# EasyEDA schematic FPC-024.json
TITLE: Sheet_1; REV: 1.0; Date: 2021-04-30; Sheet: 1/1; Drawn By: bigjohnson; Company: Your Company
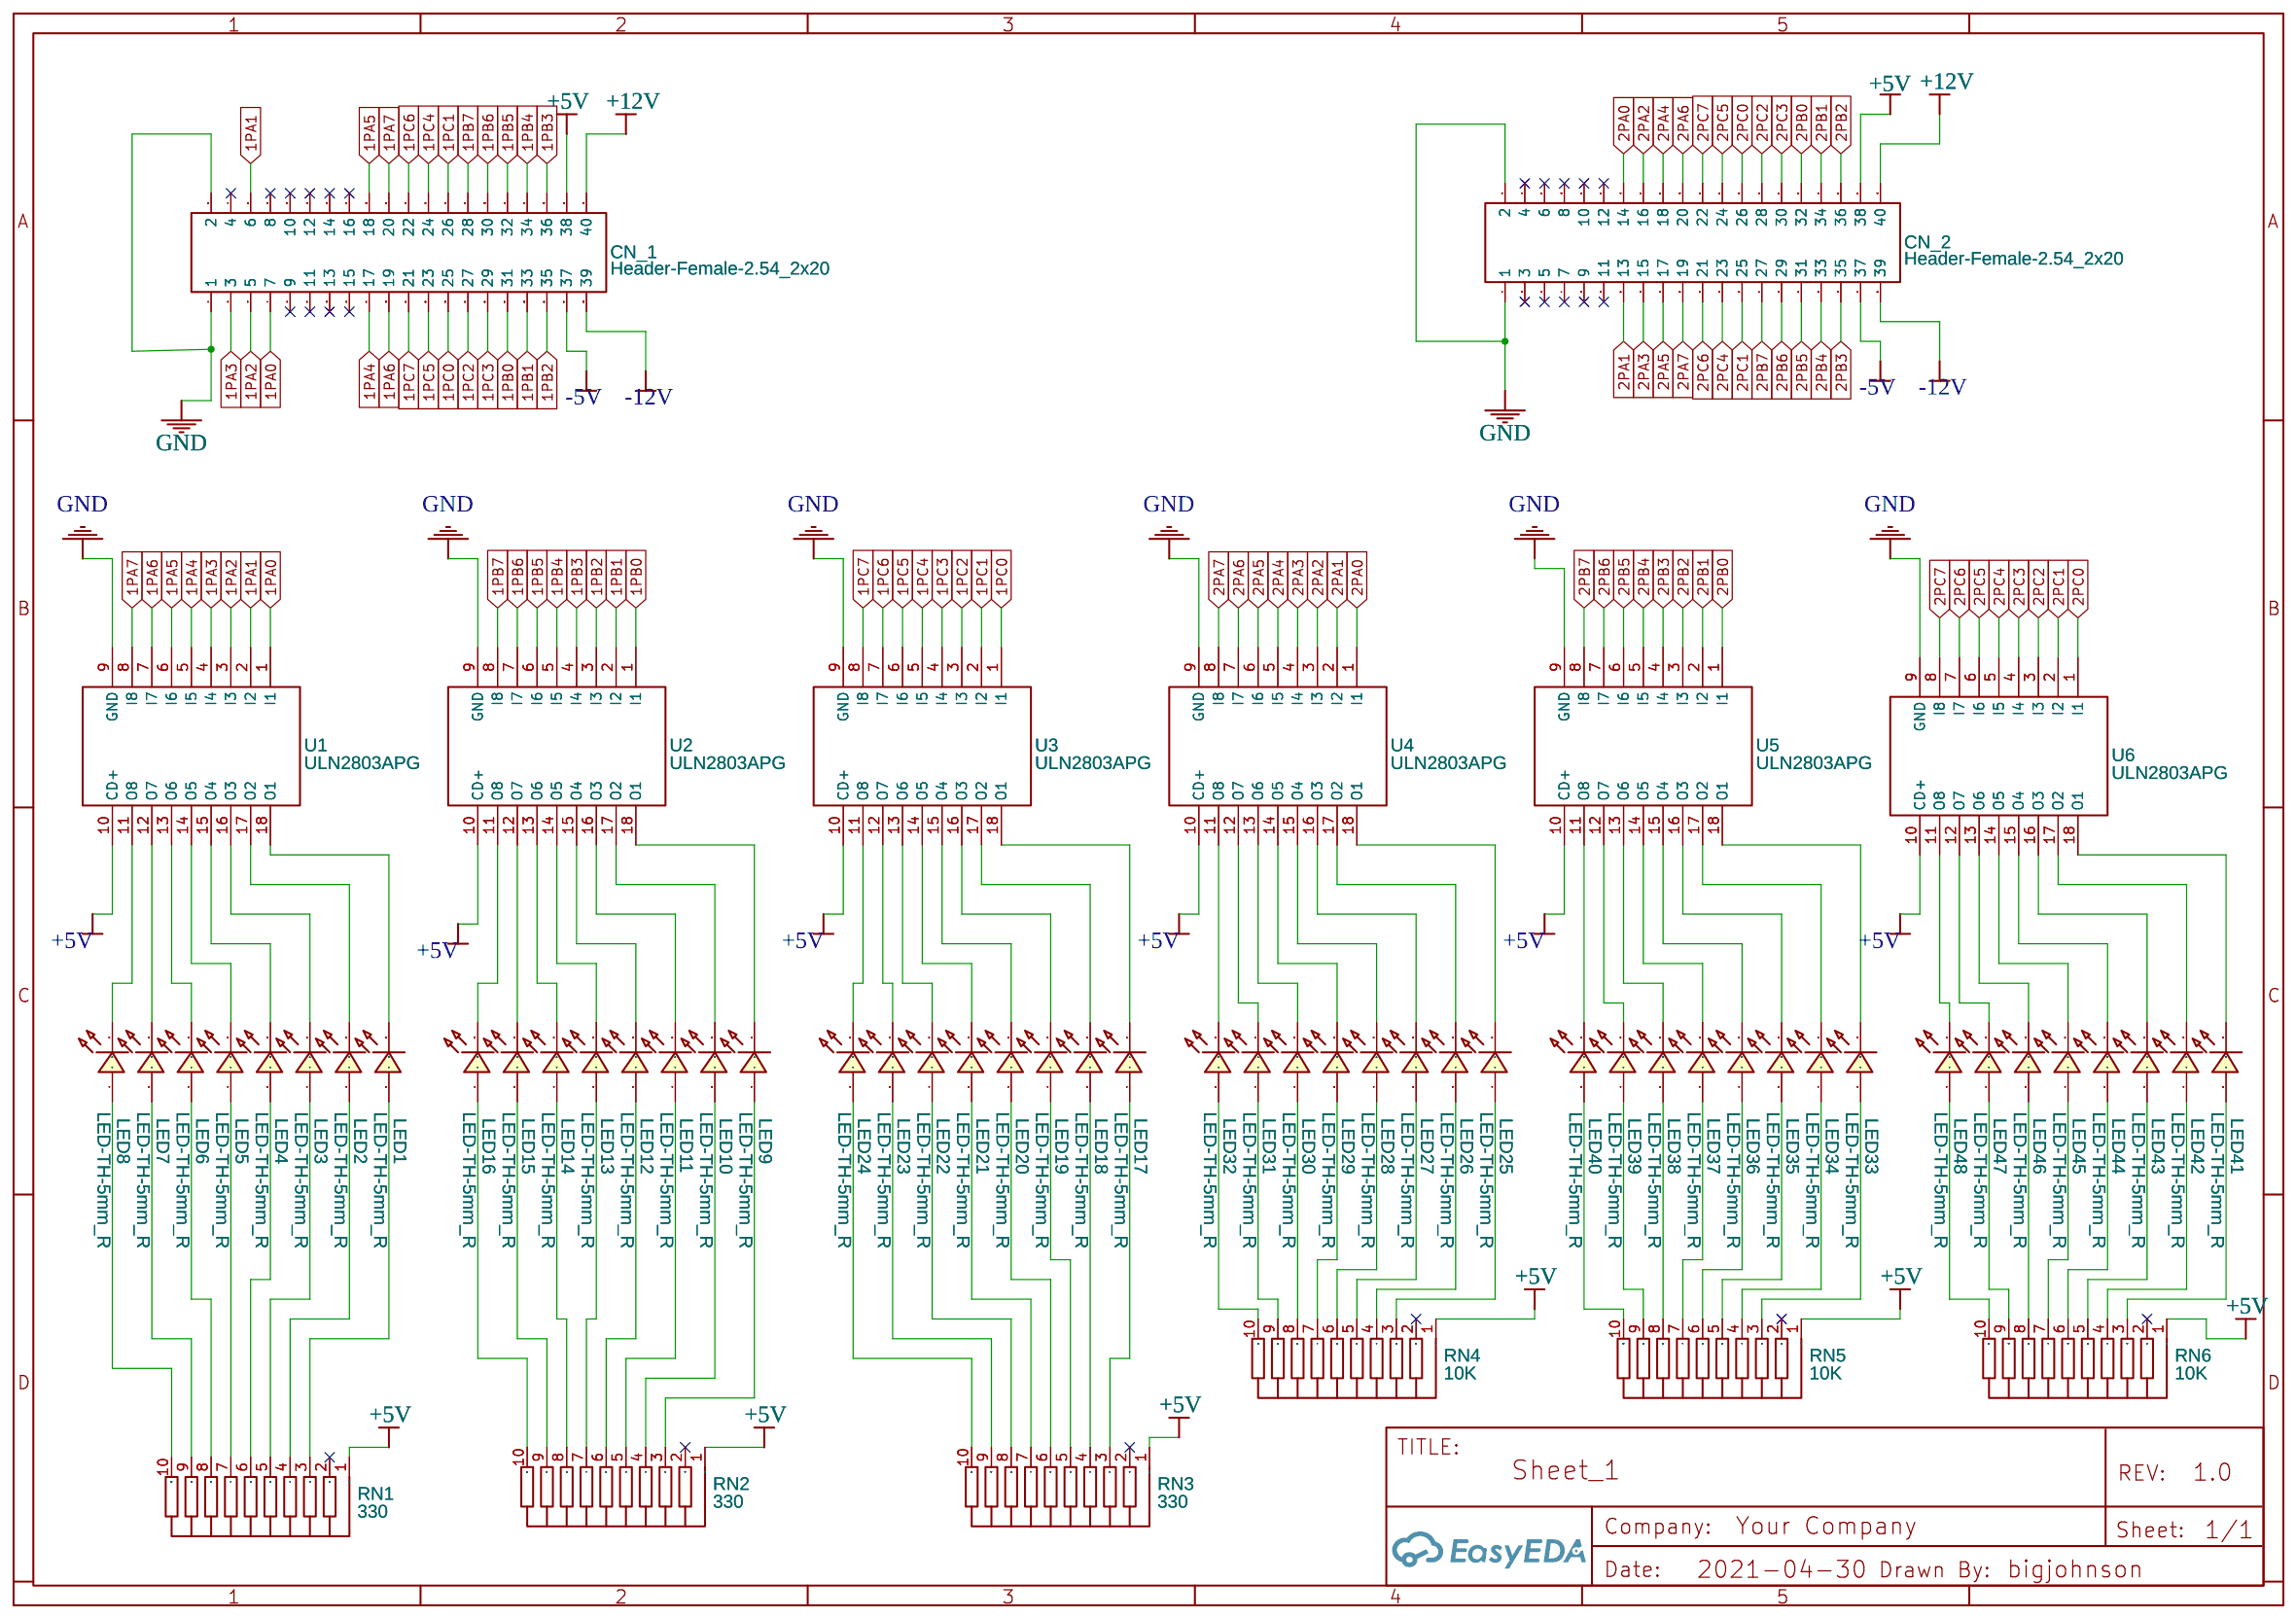
[diagram p0: schematic sheet]

## Parts
CN_1  Header-Female-2.54_2x20  [HDR-TH_40P-P2.54-V-R2-C20-S2.54]
CN_2  Header-Female-2.54_2x20  [HDR-TH_40P-P2.54-V-R2-C20-S2.54]
LED1  LED-TH-5mm_R  [LED-TH_BD5.0_RED]
LED2  LED-TH-5mm_R  [LED-TH_BD5.0_RED]
LED3  LED-TH-5mm_R  [LED-TH_BD5.0_RED]
LED4  LED-TH-5mm_R  [LED-TH_BD5.0_RED]
LED5  LED-TH-5mm_R  [LED-TH_BD5.0_RED]
LED6  LED-TH-5mm_R  [LED-TH_BD5.0_RED]
LED7  LED-TH-5mm_R  [LED-TH_BD5.0_RED]
LED8  LED-TH-5mm_R  [LED-TH_BD5.0_RED]
LED9  LED-TH-5mm_R  [LED-TH_BD5.0_RED]
LED10  LED-TH-5mm_R  [LED-TH_BD5.0_RED]
LED11  LED-TH-5mm_R  [LED-TH_BD5.0_RED]
LED12  LED-TH-5mm_R  [LED-TH_BD5.0_RED]
LED13  LED-TH-5mm_R  [LED-TH_BD5.0_RED]
LED14  LED-TH-5mm_R  [LED-TH_BD5.0_RED]
LED15  LED-TH-5mm_R  [LED-TH_BD5.0_RED]
LED16  LED-TH-5mm_R  [LED-TH_BD5.0_RED]
LED17  LED-TH-5mm_R  [LED-TH_BD5.0_RED]
LED18  LED-TH-5mm_R  [LED-TH_BD5.0_RED]
LED19  LED-TH-5mm_R  [LED-TH_BD5.0_RED]
LED20  LED-TH-5mm_R  [LED-TH_BD5.0_RED]
LED21  LED-TH-5mm_R  [LED-TH_BD5.0_RED]
LED22  LED-TH-5mm_R  [LED-TH_BD5.0_RED]
LED23  LED-TH-5mm_R  [LED-TH_BD5.0_RED]
LED24  LED-TH-5mm_R  [LED-TH_BD5.0_RED]
LED25  LED-TH-5mm_R  [LED-TH_BD5.0_RED]
LED26  LED-TH-5mm_R  [LED-TH_BD5.0_RED]
LED27  LED-TH-5mm_R  [LED-TH_BD5.0_RED]
LED28  LED-TH-5mm_R  [LED-TH_BD5.0_RED]
LED29  LED-TH-5mm_R  [LED-TH_BD5.0_RED]
LED30  LED-TH-5mm_R  [LED-TH_BD5.0_RED]
LED31  LED-TH-5mm_R  [LED-TH_BD5.0_RED]
LED32  LED-TH-5mm_R  [LED-TH_BD5.0_RED]
LED33  LED-TH-5mm_R  [LED-TH_BD5.0_RED]
LED34  LED-TH-5mm_R  [LED-TH_BD5.0_RED]
LED35  LED-TH-5mm_R  [LED-TH_BD5.0_RED]
LED36  LED-TH-5mm_R  [LED-TH_BD5.0_RED]
LED37  LED-TH-5mm_R  [LED-TH_BD5.0_RED]
LED38  LED-TH-5mm_R  [LED-TH_BD5.0_RED]
LED39  LED-TH-5mm_R  [LED-TH_BD5.0_RED]
LED40  LED-TH-5mm_R  [LED-TH_BD5.0_RED]
LED41  LED-TH-5mm_R  [LED-TH_BD5.0_RED]
LED42  LED-TH-5mm_R  [LED-TH_BD5.0_RED]
LED43  LED-TH-5mm_R  [LED-TH_BD5.0_RED]
LED44  LED-TH-5mm_R  [LED-TH_BD5.0_RED]
LED45  LED-TH-5mm_R  [LED-TH_BD5.0_RED]
LED46  LED-TH-5mm_R  [LED-TH_BD5.0_RED]
LED47  LED-TH-5mm_R  [LED-TH_BD5.0_RED]
LED48  LED-TH-5mm_R  [LED-TH_BD5.0_RED]
RN1  330  [RES-ARRAY-TH_10P-P2.54-D1.0]
RN2  330  [RES-ARRAY-TH_10P-P2.54-D1.0]
RN3  330  [RES-ARRAY-TH_10P-P2.54-D1.0]
RN4  10K  [RES-ARRAY-TH_10P-P2.54-D1.0]
RN5  10K  [RES-ARRAY-TH_10P-P2.54-D1.0]
RN6  10K  [RES-ARRAY-TH_10P-P2.54-D1.0]
U1  ULN2803APG  [DIP-18_L23.0-W6.5-P2.54-LS7.6-BL]
U2  ULN2803APG  [DIP-18_L23.0-W6.5-P2.54-LS7.6-BL]
U3  ULN2803APG  [DIP-18_L23.0-W6.5-P2.54-LS7.6-BL]
U4  ULN2803APG  [DIP-18_L23.0-W6.5-P2.54-LS7.6-BL]
U5  ULN2803APG  [DIP-18_L23.0-W6.5-P2.54-LS7.6-BL]
U6  ULN2803APG  [DIP-18_L23.0-W6.5-P2.54-LS7.6-BL]

## Library data of the parts
CN_1 CN_2 = Header-Female-2.54_2x20: Supplier: LCSC; Manufacturer: BOOMELE; Manufacturer Part: 2.54mm 2*20PFemale header; image: //image.lceda.cn/szlcsc/C50982.jpg; Supplier Part: C50982; LCSC Assembly: Yes; SMT Type: Extend; Paste Type: expand
LED1-LED48 = LED-TH-5mm_R: Manufacturer: EVERLIGHT(台湾亿光); Manufacturer Part: 333-2SURD/S530-A3; Supplier Part: C87271; Supplier: LCSC; Contributor: LCEDA_Lib
RN1-RN6 = RAA10103G: Supplier: LCSC; Supplier Part: C353599; Manufacturer: ZHUHAI MONEC ELEC; Contributor: LCSC; LCSC Assembly: Yes; SMT Type: Extend; Paste Type: expand
U1-U6 = ULN2803APG: Supplier: LCSC; Manufacturer: TOSHIBA; image: //image.lceda.cn/szlcsc/C5252.jpg; Supplier Part: C5252

## Nets
+5V: CN_1.38 CN_2.38 RN1.1 RN2.1 RN3.1 RN4.1 RN5.1 RN6.1 U1.10(CD+) U2.10(CD+) U3.10(CD+) U4.10(CD+) U5.10(CD+) U6.10(CD+)
+12V: CN_1.40 CN_2.40
-5V: CN_1.37 CN_2.37
-12V: CN_1.39 CN_2.39
GND: CN_1.1 CN_1.2 CN_2.1 CN_2.2 U1.9(GND) U2.9(GND) U3.9(GND) U4.9(GND) U5.9(GND) U6.9(GND)
1PA0: CN_1.7 U1.1(I1)
1PA1: CN_1.6 U1.2(I2)
1PA2: CN_1.5 U1.3(I3)
1PA3: CN_1.3 U1.4(I4)
1PA4: CN_1.17 U1.5(I5)
1PA5: CN_1.18 U1.6(I6)
1PA6: CN_1.19 U1.7(I7)
1PA7: CN_1.20 U1.8(I8)
1PB0: CN_1.31 U2.1(I1)
1PB1: CN_1.33 U2.2(I2)
1PB2: CN_1.35 U2.3(I3)
1PB3: CN_1.36 U2.4(I4)
1PB4: CN_1.34 U2.5(I5)
1PB5: CN_1.32 U2.6(I6)
1PB6: CN_1.30 U2.7(I7)
1PB7: CN_1.28 U2.8(I8)
1PC0: CN_1.25 U3.1(I1)
1PC1: CN_1.26 U3.2(I2)
1PC2: CN_1.27 U3.3(I3)
1PC3: CN_1.29 U3.4(I4)
1PC4: CN_1.24 U3.5(I5)
1PC5: CN_1.23 U3.6(I6)
1PC6: CN_1.22 U3.7(I7)
1PC7: CN_1.21 U3.8(I8)
2PA0: CN_2.14 U4.1(I1)
2PA1: CN_2.13 U4.2(I2)
2PA2: CN_2.16 U4.3(I3)
2PA3: CN_2.15 U4.4(I4)
2PA4: CN_2.18 U4.5(I5)
2PA5: CN_2.17 U4.6(I6)
2PA6: CN_2.20 U4.7(I7)
2PA7: CN_2.19 U4.8(I8)
2PB0: CN_2.32 U5.1(I1)
2PB1: CN_2.34 U5.2(I2)
2PB2: CN_2.36 U5.3(I3)
2PB3: CN_2.35 U5.4(I4)
2PB4: CN_2.33 U5.5(I5)
2PB5: CN_2.31 U5.6(I6)
2PB6: CN_2.29 U5.7(I7)
2PB7: CN_2.27 U5.8(I8)
2PC0: CN_2.26 U6.1(I1)
2PC1: CN_2.25 U6.2(I2)
2PC2: CN_2.28 U6.3(I3)
2PC3: CN_2.30 U6.4(I4)
2PC4: CN_2.23 U6.5(I5)
2PC5: CN_2.24 U6.6(I6)
2PC6: CN_2.21 U6.7(I7)
2PC7: CN_2.22 U6.8(I8)
Net-(LED1-1): LED1.1 RN1.3
Net-(LED1-2): LED1.2 U1.18(O1)
Net-(LED2-1): LED2.1 RN1.4
Net-(LED2-2): LED2.2 U1.17(O2)
Net-(LED3-1): LED3.1 RN1.5
Net-(LED3-2): LED3.2 U1.16(O3)
Net-(LED4-1): LED4.1 RN1.6
Net-(LED4-2): LED4.2 U1.15(O4)
Net-(LED5-1): LED5.1 RN1.7
Net-(LED5-2): LED5.2 U1.14(O5)
Net-(LED6-1): LED6.1 RN1.8
Net-(LED6-2): LED6.2 U1.13(O6)
Net-(LED7-1): LED7.1 RN1.9
Net-(LED7-2): LED7.2 U1.12(O7)
Net-(LED8-1): LED8.1 RN1.10
Net-(LED8-2): LED8.2 U1.11(O8)
Net-(LED9-1): LED9.1 RN2.3
Net-(LED9-2): LED9.2 U2.18(O1)
Net-(LED10-1): LED10.1 RN2.4
Net-(LED10-2): LED10.2 U2.17(O2)
Net-(LED11-1): LED11.1 RN2.5
Net-(LED11-2): LED11.2 U2.16(O3)
Net-(LED12-1): LED12.1 RN2.6
Net-(LED12-2): LED12.2 U2.15(O4)
Net-(LED13-1): LED13.1 RN2.7
Net-(LED13-2): LED13.2 U2.14(O5)
Net-(LED14-1): LED14.1 RN2.8
Net-(LED14-2): LED14.2 U2.13(O6)
Net-(LED15-1): LED15.1 RN2.9
Net-(LED15-2): LED15.2 U2.12(O7)
Net-(LED16-1): LED16.1 RN2.10
Net-(LED16-2): LED16.2 U2.11(O8)
Net-(LED17-1): LED17.1 RN3.3
Net-(LED17-2): LED17.2 U3.18(O1)
Net-(LED18-1): LED18.1 RN3.4
Net-(LED18-2): LED18.2 U3.17(O2)
Net-(LED19-1): LED19.1 RN3.5
Net-(LED19-2): LED19.2 U3.16(O3)
Net-(LED20-1): LED20.1 RN3.6
Net-(LED20-2): LED20.2 U3.15(O4)
Net-(LED21-1): LED21.1 RN3.7
Net-(LED21-2): LED21.2 U3.14(O5)
Net-(LED22-1): LED22.1 RN3.8
Net-(LED22-2): LED22.2 U3.13(O6)
Net-(LED23-1): LED23.1 RN3.9
Net-(LED23-2): LED23.2 U3.12(O7)
Net-(LED24-1): LED24.1 RN3.10
Net-(LED24-2): LED24.2 U3.11(O8)
Net-(LED25-1): LED25.1 RN4.3
Net-(LED25-2): LED25.2 U4.18(O1)
Net-(LED26-1): LED26.1 RN4.4
Net-(LED26-2): LED26.2 U4.17(O2)
Net-(LED27-1): LED27.1 RN4.5
Net-(LED27-2): LED27.2 U4.16(O3)
Net-(LED28-1): LED28.1 RN4.6
Net-(LED28-2): LED28.2 U4.15(O4)
Net-(LED29-1): LED29.1 RN4.7
Net-(LED29-2): LED29.2 U4.14(O5)
Net-(LED30-1): LED30.1 RN4.8
Net-(LED30-2): LED30.2 U4.13(O6)
Net-(LED31-1): LED31.1 RN4.9
Net-(LED31-2): LED31.2 U4.12(O7)
Net-(LED32-1): LED32.1 RN4.10
Net-(LED32-2): LED32.2 U4.11(O8)
Net-(LED33-1): LED33.1 RN5.3
Net-(LED33-2): LED33.2 U5.18(O1)
Net-(LED34-1): LED34.1 RN5.4
Net-(LED34-2): LED34.2 U5.17(O2)
Net-(LED35-1): LED35.1 RN5.5
Net-(LED35-2): LED35.2 U5.16(O3)
Net-(LED36-1): LED36.1 RN5.6
Net-(LED36-2): LED36.2 U5.15(O4)
Net-(LED37-1): LED37.1 RN5.7
Net-(LED37-2): LED37.2 U5.14(O5)
Net-(LED38-1): LED38.1 RN5.8
Net-(LED38-2): LED38.2 U5.13(O6)
Net-(LED39-1): LED39.1 RN5.9
Net-(LED39-2): LED39.2 U5.12(O7)
Net-(LED40-1): LED40.1 RN5.10
Net-(LED40-2): LED40.2 U5.11(O8)
Net-(LED41-1): LED41.1 RN6.3
Net-(LED41-2): LED41.2 U6.18(O1)
Net-(LED42-1): LED42.1 RN6.4
Net-(LED42-2): LED42.2 U6.17(O2)
Net-(LED43-1): LED43.1 RN6.5
Net-(LED43-2): LED43.2 U6.16(O3)
Net-(LED44-1): LED44.1 RN6.6
Net-(LED44-2): LED44.2 U6.15(O4)
Net-(LED45-1): LED45.1 RN6.7
Net-(LED45-2): LED45.2 U6.14(O5)
Net-(LED46-1): LED46.1 RN6.8
Net-(LED46-2): LED46.2 U6.13(O6)
Net-(LED47-1): LED47.1 RN6.9
Net-(LED47-2): LED47.2 U6.12(O7)
Net-(LED48-1): LED48.1 RN6.10
Net-(LED48-2): LED48.2 U6.11(O8)

Not connected (* = marked no-connect by the designer): CN_1 4* 8* 9* 10* 11* 12* 13* 14* 15* 16*; CN_2 3* 4* 5* 6* 7* 8* 9* 10* 11* 12*; RN1 2*; RN2 2*; RN3 2*; RN4 2*; RN5 2*; RN6 2*
